# EAGLE schematic 6waydistro (EAGLE 6.5.0)
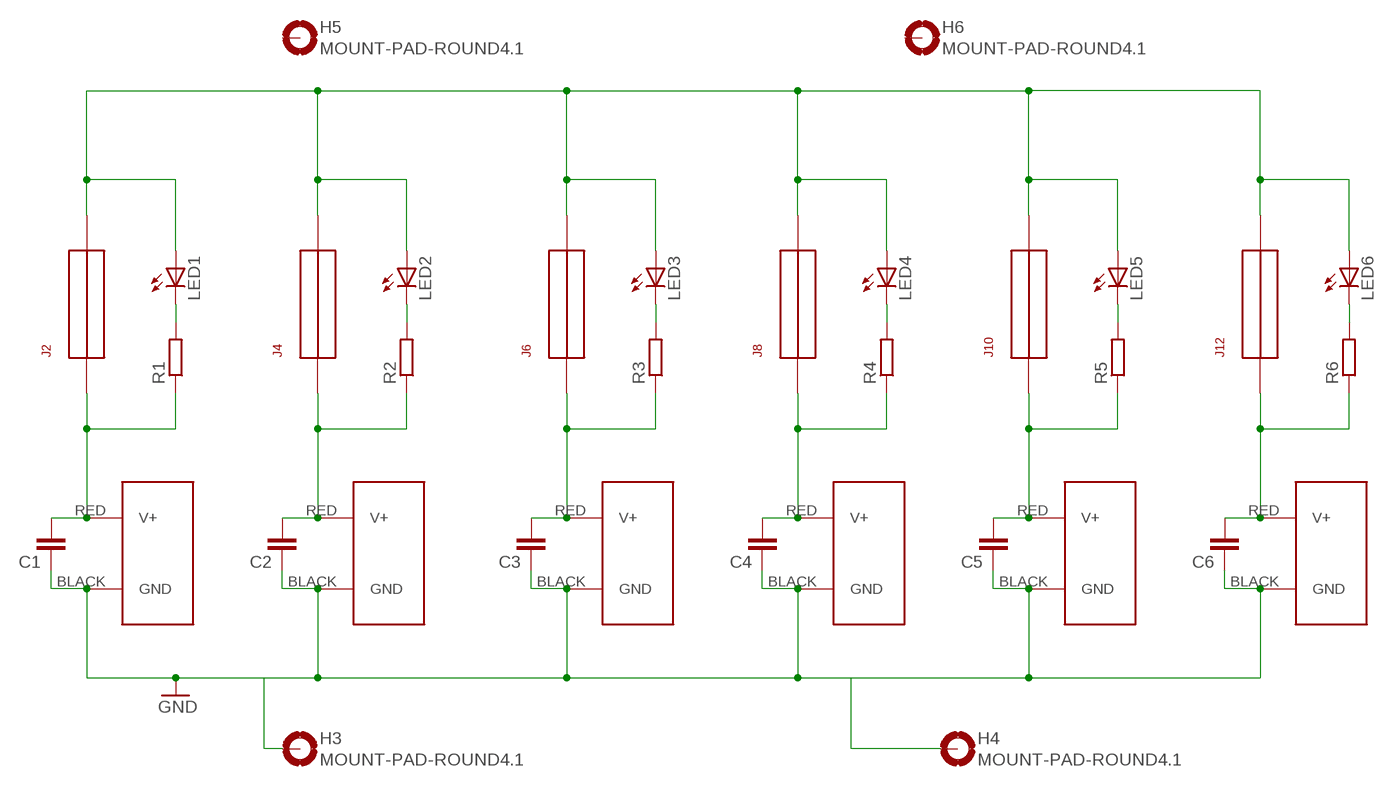
[diagram p0: schematic, sheet 1]

## Parts
C1  C-EU050-025X075  [C050-025X075]
C2  C-EU050-025X075  [C050-025X075]
C3  C-EU050-025X075  [C050-025X075]
C4  C-EU050-025X075  [C050-025X075]
C5  C-EU050-025X075  [C050-025X075]
C6  C-EU050-025X075  [C050-025X075]
H3  MOUNT-PAD-ROUND4.1  [4,1-PAD]
H4  MOUNT-PAD-ROUND4.1  [4,1-PAD]
H5  MOUNT-PAD-ROUND4.1  [4,1-PAD]
H6  MOUNT-PAD-ROUND4.1  [4,1-PAD]
J1  POWERPOLE_POWER45A  [POWERPOLE_PAIR_45A]
J2  FUSEATC  [FUSE_ATC]
J3  POWERPOLE_POWER45A  [POWERPOLE_PAIR_45A]
J4  FUSEATC  [FUSE_ATC]
J5  POWERPOLE_POWER45A  [POWERPOLE_PAIR_45A]
J6  FUSEATC  [FUSE_ATC]
J7  POWERPOLE_POWER45A  [POWERPOLE_PAIR_45A]
J8  FUSEATC  [FUSE_ATC]
J9  POWERPOLE_POWER45A  [POWERPOLE_PAIR_45A]
J10  FUSEATC  [FUSE_ATC]
J11  POWERPOLE_POWER45A  [POWERPOLE_PAIR_45A]
J12  FUSEATC  [FUSE_ATC]
LED1  LED3MM  [LED3MM]
LED2  LED3MM  [LED3MM]
LED3  LED3MM  [LED3MM]
LED4  LED3MM  [LED3MM]
LED5  LED3MM  [LED3MM]
LED6  LED3MM  [LED3MM]
R1  R-EU_0204/7  [0204/7]
R2  R-EU_0204/7  [0204/7]
R3  R-EU_0204/7  [0204/7]
R4  R-EU_0204/7  [0204/7]
R5  R-EU_0204/7  [0204/7]
R6  R-EU_0204/7  [0204/7]

## Nets
GND: C1.1 C2.1 C3.1 C4.1 C5.1 C6.1 H3.B4,1(MOUNT) H4.B4,1(MOUNT) J1.BLACK(GND) J3.BLACK(GND) J5.BLACK(GND) J7.BLACK(GND) J9.BLACK(GND) J11.BLACK(GND)
N$1: LED2.K(C) R2.2
N$2: LED1.K(C) R1.2
N$3: LED3.K(C) R3.2
N$4: LED4.K(C) R4.2
N$5: LED5.K(C) R5.2
N$6: LED6.K(C) R6.2
PPV1: C1.2 J1.RED(V+) J2.P$1 J2.P$2 R1.1
PPV2: C2.2 J3.RED(V+) J4.P$1 J4.P$2 R2.1
PPV3: C3.2 J5.RED(V+) J6.P$1 J6.P$2 R3.1
PPV4: C4.2 J7.RED(V+) J8.P$1 J8.P$2 R4.1
PPV5: C5.2 J9.RED(V+) J10.P$1 J10.P$2 R5.1
PPV6: C6.2 J11.RED(V+) J12.P$1 J12.P$2 R6.1
VCC: J2.P$3 J2.P$4 J4.P$3 J4.P$4 J6.P$3 J6.P$4 J8.P$3 J8.P$4 J10.P$3 J10.P$4 J12.P$3 J12.P$4 LED1.A LED2.A LED3.A LED4.A LED5.A LED6.A
Unconnected: H5.B4,1(MOUNT) H6.B4,1(MOUNT)

## Library data of the parts
C1-C6 = resistor:C-EU: CAPACITOR, European symbol
H3-H6 = holes:MOUNT-PAD-ROUND: MOUNTING PAD, round
J1 J3 J5 J7 J9 J11 = powerpoles:POWERPOLE_POWER: Anderson Powerpole Power Connector using ameteur radio standard layout
J2 J4 J6 J8 J10 J12 = powerpoles:FUSE
LED1-LED6 = adafruit:LED: LED OSRAM: - CHIPLED LG R971, LG N971, LY N971, LG Q971, LY Q971, LO R971, LY R971 LH N974, LH R974 LS Q976, LO Q976, LY Q976 LO Q996 - Hyper CHIPLED LW Q18S LB Q993, LB Q99A, LB R99A - SideLED LS A670, LO A670, LY A670, LG A670, LP A670 LB A673, LV A673, LT A673, LW A673 LH A674 LY A675 LS A676, LA A676, LO A676, LY A676, LW A676 LS A679, LY A679, LG A679 - Hyper Micro SIDELED® LS Y876, LA Y876, LO Y876, LY Y876 LT Y87S - SmartLED LW L88C, LW L88S LB L89C, LB L89S, LG L890 LS L89K, LO L89K, LY L89K LS L896, LA L896, LO L896, LY L896 - TOPLED LS T670, LO T670, LY T670, LG T670, LP T670 LSG T670, LSP T670, LSY T670, LOP T670, LYG T670 LG T671, LOG T671, LSG T671 LB T673, LV T673, LT T673, LW T673 LH T674 LS T676, LA T676, LO T676, LY T676, LB T676, LH T676, LSB T676, LW T676 LB T67C, LV T67C, LT T67C, LS T67K, LO T67K, LY T67K, LW E67C LS E67B, LA E67B, LO E67B, LY E67B, LB E67C, LV E67C, LT E67C LW T67C LS T679, LY T679, LG T679 LS T770, LO T770, LY T770, LG T770, LP T770 LB T773, LV T773, LT T773, LW T773 LH T774 LS E675, LA E675, LY E675, LS T675 LS T776, LA T776, LO T776, LY T776, LB T776 LHGB T686 LT T68C, LB T68C - Hyper Mini TOPLED® LB M676 - Mini TOPLED Santana® LG M470 LS M47K, LO M47K, LY M47K Source: http://www.osram.convergy.de/
R1-R6 = rcl:R-EU_: RESISTOR, European symbol